# EAGLE board InkTime_Schematic (EAGLE 9.7.0)
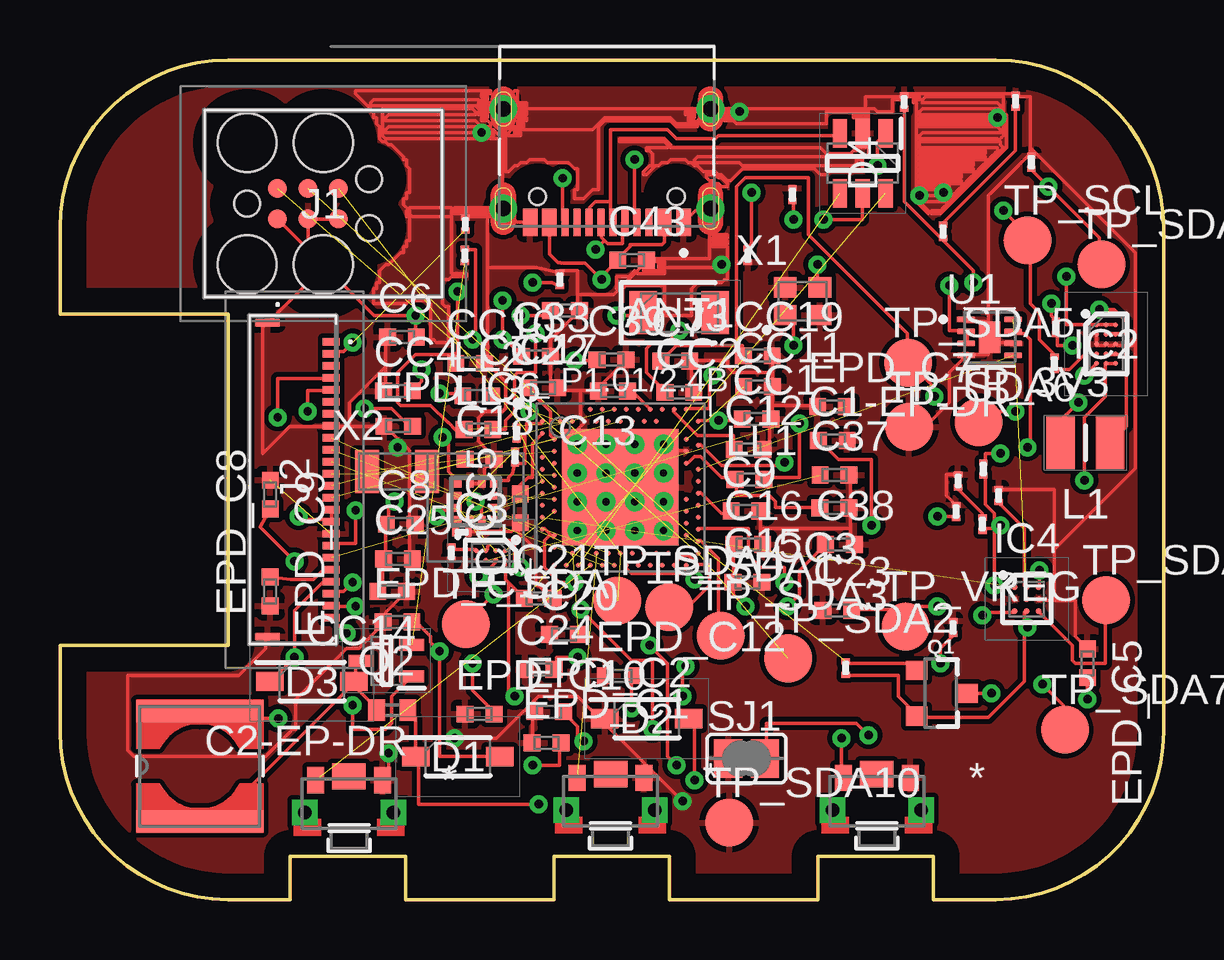
[diagram p2: board, top side]
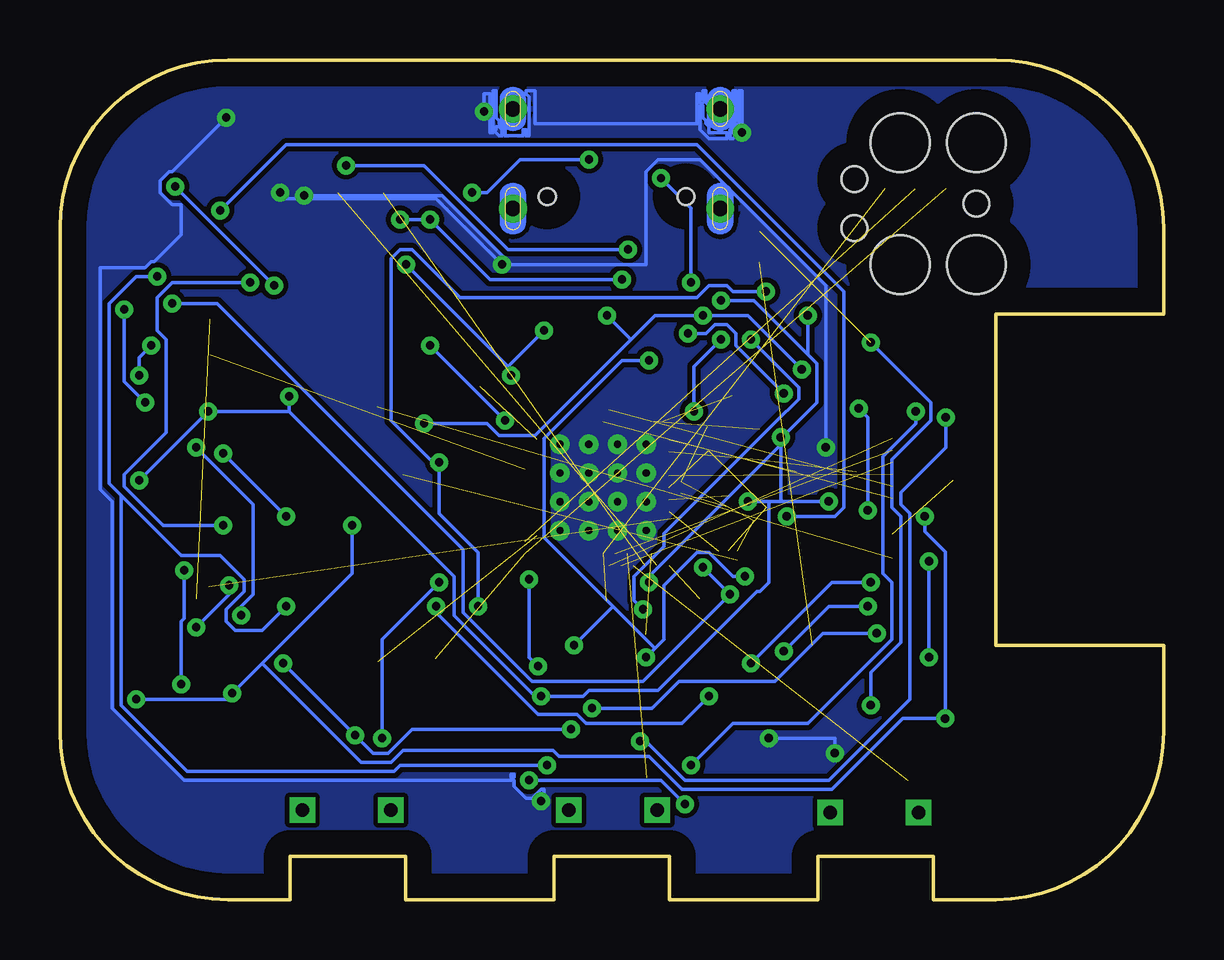
[diagram p3: board, bottom side, seen from below]

Size 46 x 35 mm. Coordinates in mm from the lower left corner, seen from the top.
Outline: 39,0 36.4,0 36.4,1.8 31.6,1.8 31.6,0 25.4,0 25.4,1.8 20.6,1.8 20.6,0 14.4,0 14.4,1.8 9.6,1.8 9.6,0 7,0 arc-90 0,7 0,10.6 7,10.6 7,24.4 0,24.4 0,28 arc-90 7,35 39,35 arc-90 46,28 46,7 arc-90 39,0
Copper layers (1*16): Top 0.035mm / dielectric 1.5mm / Bottom 0.035mm
Design rules "Fusion Electronics Design Rules": minimum track width 6mil, minimum drill 0.35mm, track to track 6mil, track to pad 6mil, pad to pad 6mil, via to via 6mil, smd to smd 6mil, copper to edge 40mil, drill to drill 6mil, minimum pad ring 10mil, minimum via ring 8mil, stop-mask expansion 4mil, vias tented up to drill 9999mil, thermal gap 10mil

## Footprints (pad centres in the part's own frame; a part is rotated, then mirrored left to right if it is on the bottom)
2450AT18B100E_ANTC3216X140N = smd 1.15 x 1.8: 1 -1.5,0; 2 1.5,0
NORDIC_NRF_3_RESC0402_M = smd 0.7 x 0.7: 1 -0.6,0; 2 0.6,0
GRM011R60J152KE01L_1_0201 = smd 0.35 x 0.25: 1 0,0.275; 2 0,-0.275
ESP32_C6_LIBRARY_1_ESP32_WROVER_EAGLE-LTSPICE_C0402 = smd 0.7 x 0.9: 1 -0.65,0; 2 0.65,0
ESP32_C6_LIBRARY_5_SOD3716X135N = smd 1.15 x 0.8: 1 -1.75,0; 2 1.75,0
ESP32_C6_LIBRARY_3_SOT95P280X145-6N = smd 1.2 x 0.6: 1 -1.25,0.95; 2 -1.25,0; 3 -1.25,-0.95; 4 1.25,-0.95; 5 1.25,0; 6 1.25,0.95
BQ25180YBGR_BGA8C40P2X4_100X155X50 = smd 0.2 x 0.2: A1 -0.2,0.6; A2 0.2,0.6; B1 -0.2,0.2; B2 0.2,0.2; C1 -0.2,-0.2; C2 0.2,-0.2; D1 -0.2,-0.6; D2 0.2,-0.6
RT6160AWSC_BGA15C40P3X5_140X230X60 = smd 0.216 x 0.216: A1 -0.4,0.8; A2 0,0.8; A3 0.4,0.8; B1 -0.4,0.4; B2 0,0.4; B3 0.4,0.4; C1 -0.4,0; C2 0,0; C3 0.4,0; D1 -0.4,-0.4; D2 0,-0.4; D3 0.4,-0.4; E1 -0.4,-0.8; E2 0,-0.8; E3 0.4,-0.8
BMA423_BMA423 = smd 0.3 x 0.35: 1 -0.75,-0.775; 2 -0.25,-0.775; 3 0.25,-0.775; 4 0.75,-0.775; 7 0.75,0.775; 8 0.25,0.775; 9 -0.25,0.775; 10 -0.75,0.775 | smd 0.35 x 0.3: 5 0.775,-0.25; 6 0.775,0.25; 11 -0.775,0.25; 12 -0.775,-0.25
DRV2605YZFR_BGA9C50P3X3_144X144X62 = smd 0.25 x 0.25: A1 -0.5,0.5; A2 0,0.5; A3 0.5,0.5; B1 -0.5,0; B2 0,0; B3 0.5,0; C1 -0.5,-0.5; C2 0,-0.5; C3 0.5,-0.5
TC2030-IDC_TC2030IDC = smd 0.783 x 0.783: 1 -0.953,-0.635; 2 -0.953,0.635; 3 0.317,-0.635; 4 0.317,0.635; 5 1.588,-0.635; 6 1.588,0.635 | hole 2.451: -2.223,-2.54; -2.223,2.54; 0.952,-2.54; 0.952,2.54 | hole 1.067: -2.223,0; 2.857,-1.016; 2.857,1.016
503480-2400_5034802400 = smd 0.3 x 0.7: 1 -5.75,1.525; 2 -5.25,1.525; 3 -4.75,1.525; 4 -4.25,1.525; 5 -3.75,1.525; 6 -3.25,1.525; 7 -2.75,1.525; 8 -2.25,1.525; 9 -1.75,1.525; 10 -1.25,1.525; 11 -0.75,1.525; 12 -0.25,1.525; 13 0.25,1.525; 14 0.75,1.525; 15 1.25,1.525; 16 1.75,1.525; 17 2.25,1.525; 18 2.75,1.525; 19 3.25,1.525; 20 3.75,1.525; 21 4.25,1.525; 22 4.75,1.525; 23 5.25,1.525; 24 5.75,1.525 | smd 0.3 x 1: MP1 -6.54,-1.125; MP2 6.54,-1.125
KH-TYPE-C-16P_KINGHELM_KH-TYPE-C-16P = smd 0.6 x 1.15: A1_B12 -3.2,4.725; A4_B9 -2.4,4.725; A9_B4 2.4,4.725; A12_B1 3.2,4.725 | smd 0.3 x 1.15: A5 -1.25,4.725; A6 -0.25,4.725; A7 0.25,4.725; A8 1.25,4.725; B5 1.75,4.725; B6 0.75,4.725; B7 -0.75,4.725; B8 -1.75,4.725 | drill 0.65 pad 1.05: SH1 -4.32,0; SH2 4.32,0; SH3 -4.32,4.15; SH4 4.32,4.15 | hole 0.7: -2.89,3.65; 2.89,3.65
MLP2016SR47MT0S1_INDC2016X100N = smd 1.2 x 2.2: 1 -1.028,0; 2 1.028,0
ESP32_C6_LIBRARY_2_IND_4828-WE-TPC_WRE = smd 0.9 x 5.3: 1 -2.286,0; 2 2.286,0
NORDIC_NRF_2_RESC0402_M = smd 0.7 x 0.7: 1 -0.6,0; 2 0.6,0
NORDIC_NRF_4_AQFN50P700X700X85_HS-74N = smd 4.85 x 4.85: P$74 0,0 | drill 0.3 pad 0.6: P$75 -1.8,1.8; P$76 -0.6,1.8; P$77 0.6,1.8; P$78 1.8,1.8; P$79 -1.8,0.6; P$80 -0.6,0.6; P$81 0.6,0.6; P$82 1.8,0.6; P$83 -1.8,-0.6; P$84 -0.6,-0.6; P$85 0.6,-0.6; P$86 1.8,-0.6; P$87 -1.8,-1.8; P$88 -0.6,-1.8; P$89 0.6,-1.8; P$90 1.8,-1.8 | smd 0.2 x 0.2: P$A8 -1.25,3.25; P$A10 -0.75,3.25; P$A12 -0.25,3.25; P$A14 0.25,3.25; P$A16 0.75,3.25; P$A18 1.25,3.25; P$A20 1.75,3.25; P$A22 2.25,3.25; P$A23 2.75,3.25; P$AA24 3.25,-2.25; P$AB2 -2.75,-2.5; P$AC5 -2,-2.75; P$AC9 -1,-2.75; P$AC11 -0.5,-2.75; P$AC13 0,-2.75; P$AC15 0.5,-2.75; P$AC17 1,-2.75; P$AC19 1.5,-2.75; P$AC21 2,-2.75; P$AC24 3.25,-2.75; P$AD2 -2.75,-3.25; P$AD4 -2.25,-3.25; P$AD6 -1.75,-3.25; P$AD8 -1.25,-3.25; P$AD10 -0.75,-3.25; P$AD12 -0.25,-3.25; P$AD14 0.25,-3.25; P$AD16 0.75,-3.25; P$AD18 1.25,-3.25; P$AD20 1.75,-3.25; P$AD22 2.25,-3.25; P$AD23 2.75,-3.25; P$B1 -3.25,2.75; P$B3 -2.5,2.75; P$B5 -2,2.75; P$B7 -1.5,2.75; P$B9 -1,2.75; P$B11 -0.5,2.75; P$B13 0,2.75; P$B15 0.5,2.75; P$B17 1,2.75; P$B19 1.5,2.75; P$B24 3.25,2.75; P$C1 -3.25,2.25; P$D2 -2.75,2; P$D23 2.75,2; P$E24 3.25,1.75; P$F2 -2.75,1.5; P$F23 2.75,1.5; P$G1 -3.25,1.25; P$H2 -2.75,1; P$H23 2.75,1; P$J1 -3.25,0.75; P$J24 3.25,0.75; P$K2 -2.75,0.5; P$L1 -3.25,0.25; P$L24 3.25,0.25; P$M2 -2.75,0; P$N1 -3.25,-0.25; P$N24 3.25,-0.25; P$P2 -2.75,-0.5; P$P23 2.75,-0.5; P$R1 -3.25,-0.75; P$R24 3.25,-0.75; P$T2 -2.75,-1; P$T23 2.75,-1; P$U1 -3.25,-1.25; P$U24 3.25,-1.25; P$V23 2.75,-1.5; P$W1 -3.25,-1.75; P$W24 3.25,-1.75; P$Y2 -2.75,-2; P$Y23 2.75,-2
ESP32_C6_LIBRARY_4_ESP32_C6_LIBRARY_4_ESP32_C6_LIBRARY_4_ESP32_C6_LIBRARY_4_ESP32_WROVER_SPARKFUN-DISCRETESEMI_SOT23-3 = smd 0.8 x 0.9: 1 -0.95,-1; 2 0.95,-1; 3 0,1.1
ESP32_C6_LIBRARY_6_SOT65P210X110-3N = smd 1.05 x 0.5: 1 -1.05,0.65; 2 -1.05,-0.65; 3 1.05,0
CPF0201D7K68C1_0201 = smd 0.35 x 0.25: 1 0,0.275; 2 0,-0.275
ESP32_C6_LIBRARY_7_JUMPER_SJ = smd 1.168 x 1.6: 1 -0.762,0; 2 0.762,0
2025-10-22_07-23-44_LIBRARY_SW_EVP-AKE31A_PAN = smd 0.711 x 1.092: 1 -1.4,-0.972; 2 1.4,-0.972 | drill 0.559 pad 0.914 square: 3 -1.848,0.381; 4 1.848,0.381 | smd 1.397 x 1.092: 5 0,-1.124
HECTOR_WATCH_1_TP20R = smd 2 x 2: TP 0,0
ESP32_C6_LIBRARY_SON50P200X200X80-9N = smd 0.76 x 0.27: 1 -0.985,0.75; 2 -0.985,0.25; 3 -0.985,-0.25; 4 -0.985,-0.75; 5 0.985,-0.75; 6 0.985,-0.25; 7 0.985,0.25; 8 0.985,0.75 | smd 0.9 x 1.3: 9 0,0
NORDIC_NRF_BT-XTAL_2016_N = smd 0.95 x 0.85: 1 -0.725,-0.575; 2 0.725,-0.575; 3 0.725,0.575; 4 -0.725,0.575
NORDIC_NRF_1_XTAL_3215_N = smd 1 x 1.8: 1 -1.25,0; 2 1.25,0

## Placement (x,y rotation side)
ANT1  2450AT18B100E_2450AT18B100E  [2450AT18B100E_ANTC3216X140N]  25.82,24.46 0 top
C1-EP-DR  10uF  [NORDIC_NRF_3_RESC0402_M]  32.21,19.13 0 top
C2  GRM011R60J152KE01L_1_GRM011R60J152KE01L  [GRM011R60J152KE01L_1_0201]  40.49,30.74 0 top
C2-EP-DR  4.7uF/25V  [ESP32_C6_LIBRARY_1_ESP32_WROVER_EAGLE-LTSPICE_C0402]  13.85,7.9 180 top
C3  1uF  [GRM011R60J152KE01L_1_0201]  39.13,16.85 0 top
C4  0.1uF  [GRM011R60J152KE01L_1_0201]  35.19,33.25 0 top
C5  GRM011R60J152KE01L_1_GRM011R60J152KE01L  [GRM011R60J152KE01L_1_0201]  37.35,16.18 0 top
C6  4.7uF  [NORDIC_NRF_3_RESC0402_M]  14.25,23.45 0 top
C7  100nF  [NORDIC_NRF_3_RESC0402_M]  25.65,22.45 0 top
C8  100nF  [NORDIC_NRF_3_RESC0402_M]  14.2,15.65 0 top
C9  820pF  [NORDIC_NRF_3_RESC0402_M]  28.58,16.19 0 top
C10  GRM011R60J152KE01L_1_GRM011R60J152KE01L  [GRM011R60J152KE01L_1_0201]  37.44,17.45 0 top
C11  GRM011R60J152KE01L_1_GRM011R60J152KE01L  [GRM011R60J152KE01L_1_0201]  39.84,33.28 0 top
C12  100pF  [NORDIC_NRF_3_RESC0402_M]  28.7,18.76 0 top
C13  N.C  [NORDIC_NRF_3_RESC0402_M]  23.05,21.2 180 top
C15  1uF  [NORDIC_NRF_3_RESC0402_M]  28.66,13.23 0 top
C16  47nF  [NORDIC_NRF_3_RESC0402_M]  28.69,14.8 0 top
C17  12pF  [NORDIC_NRF_3_RESC0402_M]  20.14,21.33 0 top
C18  12pF  [NORDIC_NRF_3_RESC0402_M]  17.49,18.35 0 top
C20  4.7uF  [NORDIC_NRF_3_RESC0402_M]  21,11.05 0 top
C21  4.7uF  [NORDIC_NRF_3_RESC0402_M]  19.95,12.55 0 top
C23  0.1uF  [NORDIC_NRF_3_RESC0402_M]  32.4,12.05 0 top
C24  10uF  [NORDIC_NRF_3_RESC0402_M]  19.99,9.6 0 top
C25  22uF  [NORDIC_NRF_3_RESC0402_M]  14.09,14.2 0 top
C33  22uF  [NORDIC_NRF_3_RESC0402_M]  19.84,22.64 0 top
C37  1uF  [NORDIC_NRF_3_RESC0402_M]  32.29,17.7 0 top
C38  1uF  [NORDIC_NRF_3_RESC0402_M]  32.51,14.8 0 top
C39  10uF  [NORDIC_NRF_3_RESC0402_M]  22.99,22.5 0 top
C42  GRM011R60J152KE01L_1_GRM011R60J152KE01L  [GRM011R60J152KE01L_1_0201]  30.53,29.38 0 top
C43  4.7uF  [NORDIC_NRF_3_RESC0402_M]  23.85,26.65 0 top
CC1  12pF  [NORDIC_NRF_3_RESC0402_M]  29.04,20.03 0 top
CC2  12pF  [NORDIC_NRF_3_RESC0402_M]  25.82,21.14 0 top
CC3  1pF  [NORDIC_NRF_3_RESC0402_M]  32.28,16.32 180 top
CC4  1pF  [NORDIC_NRF_3_RESC0402_M]  14.09,21.2 0 top
CC5  100nF  [NORDIC_NRF_3_RESC0402_M]  19.19,16.31 90 top
CC10  N.C  [NORDIC_NRF_3_RESC0402_M]  17.1,22.35 0 top
CC11  100pF  [NORDIC_NRF_3_RESC0402_M]  29.1,21.38 0 top
CC14  4.7uF  [NORDIC_NRF_3_RESC0402_M]  13.85,12.85 180 top
CC19  100nF  [NORDIC_NRF_3_RESC0402_M]  29.09,22.67 0 top
CC22  N.C  [NORDIC_NRF_3_RESC0402_M]  21.05,24.55 180 top
D1  ESP32_C6_LIBRARY_5_MBR0530  [ESP32_C6_LIBRARY_5_SOD3716X135N]  16.59,5.96 0 top
D2  ESP32_C6_LIBRARY_5_MBR0530  [ESP32_C6_LIBRARY_5_SOD3716X135N]  24.46,7.54 0 top
D3  ESP32_C6_LIBRARY_5_MBR0530  [ESP32_C6_LIBRARY_5_SOD3716X135N]  10.5,9.09 0 top
D4  ESP32_C6_LIBRARY_3_USBLC6-2SC6Y  [ESP32_C6_LIBRARY_3_SOT95P280X145-6N]  33.46,30.69 270 top
EPD_C1  1uF/50V  [NORDIC_NRF_3_RESC0402_M]  20.28,6.53 0 top
EPD_C2  1uF/50V  [NORDIC_NRF_3_RESC0402_M]  20.39,7.83 0 top
EPD_C5  0.1uF/50V  [NORDIC_NRF_3_RESC0402_M]  42.83,9.85 270 top
EPD_C6  1uF/50V  [NORDIC_NRF_3_RESC0402_M]  14.1,19.73 0 top
EPD_C7  1uF/50V  [NORDIC_NRF_3_RESC0402_M]  32.18,20.55 0 top
EPD_C8  1uF/50V  [NORDIC_NRF_3_RESC0402_M]  8.77,12.84 90 top
EPD_C9  1uF/50V  [NORDIC_NRF_3_RESC0402_M]  8.77,16.88 270 top
EPD_C10  1uF/50V  [NORDIC_NRF_3_RESC0402_M]  17.49,7.73 0 top
EPD_C11  1uF/50V  [NORDIC_NRF_3_RESC0402_M]  14.07,11.58 0 top
EPD_C12  1uF/50V  [NORDIC_NRF_3_RESC0402_M]  23.33,9.33 0 top
IC1  BQ25180YBGR_BQ25180YBGR  [BQ25180YBGR_BGA8C40P2X4_100X155X50]  17.96,14.34 270 top
IC2  RT6160AWSC_RT6160AWSC  [RT6160AWSC_BGA15C40P3X5_140X230X60]  43.61,23.16 0 top
IC3  BMA423_BMA423  [BMA423_BMA423]  17.33,16.59 0 top
IC4  DRV2605YZFR_DRV2605YZFR  [DRV2605YZFR_BGA9C50P3X3_144X144X62]  40.3,12.53 0 top
J1  TC2030-IDC_TC2030-IDC  [TC2030-IDC_TC2030IDC]  10.02,29.01 0 top
J2  503480-2400_503480-2400  [503480-2400_5034802400]  9.78,17.5 270 top
J3  KH-TYPE-C-16P_KH-TYPE-C-16P  [KH-TYPE-C-16P_KINGHELM_KH-TYPE-C-16P]  22.8,32.96 180 top
L1  MLP2016SR47MT0S1_FTC252012SR47MBCA  [MLP2016SR47MT0S1_INDC2016X100N]  42.74,19.04 0 top
L2  ESP32_C6_LIBRARY_2_744043680IND_4828-WE-TPC_WRE  [ESP32_C6_LIBRARY_2_IND_4828-WE-TPC_WRE]  5.83,5.56 90 top
LL1  3.9nH  [NORDIC_NRF_2_RESC0402_M]  28.74,17.5 0 top
LL2  10uH  [NORDIC_NRF_2_RESC0402_M]  17.39,21 0 top
LL3  15uH  [NORDIC_NRF_2_RESC0402_M]  17.44,19.6 0 top
P1.01/2.4B  NORDIC_NRF_4_NRF52840_QF  [NORDIC_NRF_4_AQFN50P700X700X85_HS-74N]  23.36,17.18 0 top
Q1  20V/4.2A/52mΩ/1.4W  [ESP32_C6_LIBRARY_4_ESP32_C6_LIBRARY_4_ESP32_C6_LIBRARY_4_ESP32_C6_LIBRARY_4_ESP32_WROVER_SPARKFUN-DISCRETESEMI_SOT23-3]  36.71,8.6 270 top
Q2  ESP32_C6_LIBRARY_6_SI1308EDL-T1-GE3  [ESP32_C6_LIBRARY_6_SOT65P210X110-3N]  13.61,9.96 180 top
R1  10K  [CPF0201D7K68C1_0201]  16.31,14.45 180 top
R2  CPF0201D7K68C1_CPF0201D7K68C1  [CPF0201D7K68C1_0201]  41.45,22.35 0 top
R3  CPF0201D7K68C1_CPF0201D7K68C1  [CPF0201D7K68C1_0201]  41.51,23.85 0 top
R4  CPF0201D7K68C1_CPF0201D7K68C1  [CPF0201D7K68C1_0201]  18.97,18.45 0 top
R5  CPF0201D7K68C1_CPF0201D7K68C1  [CPF0201D7K68C1_0201]  19.03,19.45 0 top
R6  CPF0201D7K68C1_CPF0201D7K68C1  [CPF0201D7K68C1_0201]  16.89,28.15 0 top
R7  CPF0201D7K68C1_CPF0201D7K68C1  [CPF0201D7K68C1_0201]  32.75,9.65 0 top
R8  CPF0201D7K68C1_CPF0201D7K68C1  [CPF0201D7K68C1_0201]  16.75,15.31 90 top
R9  CPF0201D7K68C1_CPF0201D7K68C1  [CPF0201D7K68C1_0201]  16.87,26.85 0 top
R10  CPF0201D7K68C1_CPF0201D7K68C1  [CPF0201D7K68C1_0201]  37.23,11.35 0 top
R11  CPF0201D7K68C1_CPF0201D7K68C1  [CPF0201D7K68C1_0201]  38.49,17.95 0 top
R12  CPF0201D7K68C1_CPF0201D7K68C1  [CPF0201D7K68C1_0201]  38.45,15.65 0 top
R13  CPF0201D7K68C1_CPF0201D7K68C1  [CPF0201D7K68C1_0201]  36.81,27.85 0 top
R14  CPF0201D7K68C1_CPF0201D7K68C1  [CPF0201D7K68C1_0201]  28.67,26.85 0 top
R15  CPF0201D7K68C1_CPF0201D7K68C1  [CPF0201D7K68C1_0201]  20.83,25.85 0 top
SJ1  0  [ESP32_C6_LIBRARY_7_JUMPER_SJ]  28.62,5.88 0 top
SW1  2025-10-22_07-23-44_LIBRARY_EVP-AKE31ASW_EVP-AKE31A_PAN  [2025-10-22_07-23-44_LIBRARY_SW_EVP-AKE31A_PAN]  12.05,4.01 180 top
SW2  2025-10-22_07-23-44_LIBRARY_EVP-AKE31ASW_EVP-AKE31A_PAN  [2025-10-22_07-23-44_LIBRARY_SW_EVP-AKE31A_PAN]  22.95,4.11 180 top
SW3  2025-10-22_07-23-44_LIBRARY_EVP-AKE31ASW_EVP-AKE31A_PAN  [2025-10-22_07-23-44_LIBRARY_SW_EVP-AKE31A_PAN]  34.05,4.11 180 top
TP_3V3  HECTOR_WATCH_1_TPTP20R  [HECTOR_WATCH_1_TP20R]  38.3,19.9 0 top
TP_SCL  HECTOR_WATCH_1_TPTP20R  [HECTOR_WATCH_1_TP20R]  40.33,27.48 0 top
TP_SDA  HECTOR_WATCH_1_TPTP20R  [HECTOR_WATCH_1_TP20R]  16.92,11.48 0 top
TP_SDA1  HECTOR_WATCH_1_TPTP20R  [HECTOR_WATCH_1_TP20R]  25.39,12.19 0 top
TP_SDA2  HECTOR_WATCH_1_TPTP20R  [HECTOR_WATCH_1_TP20R]  30.35,10.05 0 top
TP_SDA3  HECTOR_WATCH_1_TPTP20R  [HECTOR_WATCH_1_TP20R]  27.55,11 0 top
TP_SDA4  HECTOR_WATCH_1_TPTP20R  [HECTOR_WATCH_1_TP20R]  23.23,12.46 0 top
TP_SDA5  HECTOR_WATCH_1_TPTP20R  [HECTOR_WATCH_1_TP20R]  35.35,22.38 0 top
TP_SDA6  HECTOR_WATCH_1_TPTP20R  [HECTOR_WATCH_1_TP20R]  35.39,19.7 0 top
TP_SDA7  HECTOR_WATCH_1_TPTP20R  [HECTOR_WATCH_1_TP20R]  41.89,7.08 0 top
TP_SDA8  HECTOR_WATCH_1_TPTP20R  [HECTOR_WATCH_1_TP20R]  43.61,12.48 0 top
TP_SDA9  HECTOR_WATCH_1_TPTP20R  [HECTOR_WATCH_1_TP20R]  43.41,26.48 0 top
TP_SDA10  HECTOR_WATCH_1_TPTP20R  [HECTOR_WATCH_1_TP20R]  27.9,3.2 0 top
TP_VREG  HECTOR_WATCH_1_TPTP20R  [HECTOR_WATCH_1_TP20R]  35.25,11.38 0 top
U1  ESP32_C6_LIBRARY_MAX17048G+T10  [ESP32_C6_LIBRARY_SON50P200X200X80-9N]  38.75,23.44 0 top
X1  32MHz  [NORDIC_NRF_BT-XTAL_2016_N]  30.96,24.94 0 top
X2  32.768KHz  [NORDIC_NRF_1_XTAL_3215_N]  14.06,17.84 0 top

## Tracks (layer width: path | path; a pad name or v marks a point on that pad's centre or on a via)
3V3/1.7D  (via drill 0.35)
  Top 0.152: C4.2 35.2,29.1 36.7,27.6 R13.2 36.83,27.48 38.08,26.23 v38.08,25.73 | 38.95,15.48 38.45,15.48 R12.2 | 38.95,15.6 38.95,16.1 38.58,16.48 38.58,17.6 R11.2 | 38.95,15.6 38.95,15.48 | 40.2,11.35 40.2,9.1 38.7,7.6 35.83,7.6 Q1.2 35.7,7.73 34.95,8.48 34.95,9.35 32.83,9.35 R7.2 | 40.2,11.35 40.2,11.98 IC4.C2 | v38.95,13.1 38.95,15.48 | 40.2,11.35 v40.33,11.35 | 38.95,15.6 v39.2,15.6
  Bottom 0.152: v38.95,13.1 38.95,12.73 v40.33,11.35 | v38.08,25.73 41.33,25.73 41.95,25.1 41.95,23.73 41.58,23.35 41.58,19.48 43.33,17.73 43.33,17.23 41.7,15.6 v39.2,15.6
3V3/2.4A  (via drill 0.35)
  Top 0.152: C7.1 25.7,23.1 28.2,23.1 | 28.2,23.1 28.45,23.1 28.45,22.73 CC19.1 | 28.2,23.1 28.2,29.73 28.57,30.1 31.2,30.1 31.2,27.73 35.33,23.6 35.33,22.48 TP_SDA5.TP 35.45,22.35 36.45,21.35 v36.45,20.98 | IC2.E3 43.95,22.35 43.7,22.35 IC2.E2 43.58,22.35 43.58,20.98 42.7,20.1 v42.7,17.48 | v39.83,20.35 38.33,20.35 38.33,19.98 TP_3V3.TP | IC3.7 18.2,17.48 18.7,17.48 18.7,17.6 18.86,17.76 18.94,18.15 R4.2 19.38,18.18 19.38,19.33 19.34,19.36 | 19.57,19.85 19.45,19.85 19.45,19.48 19.34,19.36 | 19.57,19.85 20.07,19.85 P1.01/2.4B.P$B1 | 19.34,19.36 19.07,19.1 R5.2 | CC14.2 13.32,12.85 13.45,12.98 13.45,14.1 C25.1 13.57,14.23 13.57,15.6 C8.1 13.7,15.73 13.7,16.35 v13.95,16.6 | 26.07,13.6 23.82,13.6 23.57,13.85 P1.01/2.4B.P$AD14 | 26.07,13.6 26.07,13.85 P1.01/2.4B.P$AD23 | 20.45,15.23 20.57,15.1 P1.01/2.4B.P$Y2 | 20.45,15.23 20.2,15.48 P1.01/2.4B.P$W1 | v17.32,16.6 17.57,16.35 17.57,15.85 IC3.3 | IC3.10 16.57,17.48 16.2,17.85 16.2,18.98 15.95,19.23 v15.95,19.27 | 20.45,15.23 20.2,14.98 20.2,13.85 20.82,13.23 v21.45,13.23 | C6.2 14.82,23.48 v14.82,24.35 13.09,24.35 J1.1 | 18.45,23.48 19.2,22.73 C33.1 | 18.45,23.48 v18.45,24.98 | 26.07,13.6 26.45,13.6 v26.45,13.35 | v26.07,9.73 25.95,9.6 v25.95,8.48 | 19.57,19.85 v19.57,20.35 | 18.45,23.48 v18.45,23.35
  Bottom 0.152: v42.7,17.48 v39.83,20.35 36.45,20.35 | v13.95,16.6 15.95,16.6 | 15.95,16.6 16.45,16.6 | 16.45,16.6 v17.32,16.6 | 15.95,16.6 15.95,18.98 | v21.45,13.23 21.45,13.48 15.95,18.98 | 15.95,18.98 15.95,19.23 | 14.82,22.73 v14.82,24.35 | 14.82,22.73 14.45,22.35 14.45,20.73 15.95,19.23 | v18.45,24.98 17.07,24.98 14.82,22.73 | v26.45,13.35 26.45,10.1 v26.07,9.73 | 16.45,16.6 16.45,13.23 16.82,12.85 16.95,12.85 21.07,8.73 23.95,8.73 24.2,8.48 v25.95,8.48 26.2,8.48 29.57,11.85 29.57,13.48 36.45,20.35 | v19.57,20.35 19.57,22.23 v18.45,23.35 | 36.45,20.35 v36.45,20.98 | v15.95,19.27 15.95,19.23
ALERT  (1 unrouted)
D+  (1 unrouted)
D-  (1 unrouted)
DN  (via drill 0.35)
  Top 0.152: 22.7,27.48 22.82,27.35 23.45,27.35 23.45,28.23 J3.B7 | 22.7,27.48 22.57,27.6 22.57,28.23 J3.A7 | v34.08,30.6 34.08,31.6 34.33,31.85 D4.1 | 22.7,27.48 v22.32,27.1
  Bottom 0.152: v34.08,30.6 30.82,30.6 27.32,27.1 v22.32,27.1
DP
  Top 0.152: 22.95,29.1 22.32,29.1 22.07,28.85 22.07,28.35 J3.B6 | 22.95,29.1 22.95,28.35 J3.A6 | 22.95,29.1 22.95,32.1 25.32,32.1 25.7,31.73 27.32,31.73 27.45,31.85 32.45,31.85 D4.3
EPD_3V3  (via drill 0.35)
  Top 0.152: J2.15 11.32,16.23 11.32,15.85 J2.16 11.2,15.85 9.95,15.85 v9.95,15.98 | v9.1,7.55 5.95,7.55 5.95,7.73 L2.2 | v42.83,8.35 42.83,9.23 EPD_C5.2 | Q1.3 v38.83,8.6 | v33.83,15.6 33.83,18.35 32.45,18.35 31.7,19.1 C1-EP-DR.1
  Bottom 0.152: v9.95,15.98 9.95,15.35 9.1,14.5 v9.1,7.55 10.88,7.55 13.82,4.6 20.07,4.6 21.45,5.98 25.2,5.98 25.45,6.23 31.7,6.23 32.2,5.73 33.45,5.73 37.58,9.85 | v42.83,8.35 39.08,8.35 v38.83,8.6 37.58,9.85 | v33.83,15.6 33.83,13.6 37.58,9.85
EPD_BUSY  (1 unrouted)
EPD_CS  (1 unrouted)
EPD_DC  (1 unrouted)
EPD_RST  (1 unrouted)
GDR  (via drill 0.35)  (1 unrouted)
  Top 0.152: v12.2,23.23 11.82,22.85 11.32,22.85 J2.2 | 16.82,27.85 R6.2 | v12.2,8.1 12.2,7.1 13.57,7.1 13.82,7.35 13.82,8.48 14.57,9.23 Q2.1
  Bottom 0.152: v12.2,8.1 12.2,9.48 10.95,10.73 10.95,15.98 11.32,16.35 11.32,18.35 9.7,19.98 9.7,20.73 v12.2,23.23
GND  (via drill 0.35)  (1 unrouted)
  Top 0.152: 29.2,15.48 29.2,16.1 C9.2 | 29.2,15.48 29.2,14.85 C16.2 | 32.95,15.48 32.95,16.23 CC3.1 32.95,16.35 32.95,17.6 C37.2 | 32.95,15.48 32.95,14.98 33.08,14.85 C38.2 | 32.95,15.48 29.2,15.48 | CC2.2 26.32,21.23 26.32,22.35 C7.2 26.32,22.48 27.82,22.48 27.82,22.23 28.07,21.98 29.7,21.98 | 29.7,21.98 29.7,22.6 CC19.2 | 29.7,21.98 CC11.2 29.7,20.6 | C12.2 29.32,18.85 29.57,19.1 29.57,19.98 CC1.2 29.7,20.1 29.7,20.6 | 29.7,20.6 31.57,20.6 EPD_C7.1 | 38.7,23.23 38.7,23.35 U1.9 | 38.7,23.23 38.7,22.73 37.83,22.73 U1.4 37.7,22.6 37.08,21.98 37.08,20.73 35.7,19.35 | 38.7,24.1 37.83,24.1 U1.1 | 38.7,24.1 38.7,23.48 U1.9 | 38.7,23.23 39.7,23.23 U1.6 | 38.7,23.23 U1.9 | 35.7,19.35 35.45,19.6 TP_SDA6.TP 35.7,19.35 | 12.07,19.73 11.32,19.73 J2.8 11.2,19.73 9.57,19.73 8.45,18.6 8.45,23.85 8.57,23.98 J2.MP1 10.34,25.73 J1.3 J1.5 | 12.07,19.73 13.45,19.73 EPD_C6.1 13.57,19.73 14.32,18.98 | 13.57,22.23 13.57,23.35 C6.1 | 13.57,22.23 13.57,21.23 CC4.1 | 12.07,19.73 12.07,20.73 13.57,22.23 | 14.32,18.98 14.57,18.73 14.57,14.23 C25.2 | 25.2,18.98 25.2,18.73 26.07,18.73 P1.01/2.4B.P$F23 | 21.57,19.1 21.57,19.6 21.82,19.85 P1.01/2.4B.P$B7 21.82,19.98 21.7,20.1 21.7,21.23 | 21.57,16.48 21.57,15.48 P1.01/2.4B.P$87 | 21.57,16.48 P1.01/2.4B.P$83 | 21.57,16.48 P1.01/2.4B.P$74 | P1.01/2.4B.P$88 22.82,15.48 22.82,16.48 P1.01/2.4B.P$74 | P1.01/2.4B.P$84 22.82,16.6 P1.01/2.4B.P$74 | P1.01/2.4B.P$79 21.57,17.85 22.07,18.35 22.07,18.48 P1.01/2.4B.P$74 | P1.01/2.4B.P$80 22.82,17.73 P1.01/2.4B.P$74 | 25.07,15.35 24.07,15.35 P1.01/2.4B.P$89 | P1.01/2.4B.P$85 23.95,16.6 P1.01/2.4B.P$74 | P1.01/2.4B.P$81 23.95,17.73 P1.01/2.4B.P$74
  Top 0.152: 25.07,15.35 P1.01/2.4B.P$90 | 25.07,15.35 P1.01/2.4B.P$74 | P1.01/2.4B.P$86 25.07,16.48 24.57,15.98 P1.01/2.4B.P$74 | 24.57,18.35 25.07,17.85 P1.01/2.4B.P$82 | 21.57,19.1 P1.01/2.4B.P$75 | 21.57,19.1 P1.01/2.4B.P$74 | P1.01/2.4B.P$76 22.7,18.98 22.2,18.48 P1.01/2.4B.P$74 | 24.57,18.35 24.57,18.48 24.07,18.98 P1.01/2.4B.P$77 | 24.57,18.35 P1.01/2.4B.P$74 | 25.2,18.98 P1.01/2.4B.P$78 | 25.2,18.98 P1.01/2.4B.P$74 | 27.07,28.73 27.07,26.73 24.45,26.73 C43.2 24.45,26.6 23.07,25.23 21.57,25.23 | 27.07,28.73 J3.SH3 27.2,28.85 27.2,29.98 27.07,29.98 26.95,30.1 26.95,30.23 27.32,30.23 27.45,30.1 27.57,30.1 27.82,29.85 27.82,29.73 27.57,29.73 27.45,29.85 27.32,29.85 27.32,28.73 27.2,28.6 27.2,27.73 27.82,27.73 27.82,27.6 27.2,27.6 27.2,27.48 27.82,27.48 27.82,27.35 27.2,27.35 27.2,27.23 27.82,27.23 27.82,25.85 27.7,25.85 27.57,25.73 26.57,25.73 26.32,25.48 26.32,24.35 25.2,24.35 25.2,25.6 23.57,25.6 23.32,25.35 23.2,25.48 23.2,25.98 23.7,25.98 23.95,26.23 24.07,26.1 25.2,26.1 25.2,26.23 24.32,26.23 24.32,26.35 24.7,26.35 24.7,26.6 25.2,26.6 25.2,26.48 24.95,26.48 24.95,26.35 27.45,26.35 v27.57,26.48 | 21.57,25.23 21.57,24.6 CC22.1 21.57,24.48 20.45,23.35 20.45,22.73 C33.2 20.45,22.6 20.45,21.6 20.7,21.35 C17.2 20.82,21.23 21.7,21.23 | 21.57,25.23 21.57,26.23 20.85,26.23 R15.1 19.88,26.35 17.82,26.35 | 21.7,21.23 22.45,21.23 | 22.45,21.23 22.45,21.35 23.57,22.48 C39.2 | 22.45,21.23 C13.2 | IC2.B1 43.2,23.48 43.2,23.23 IC2.C1 43.2,23.1 43.58,23.1 IC2.C2 43.7,23.1 43.95,23.1 IC2.C3 44.08,23.1 44.83,23.1 | 41.45,12.48 42.33,12.48 42.33,10.98 42.83,10.48 EPD_C5.1
  Top 0.152: 41.45,12.48 40.83,12.48 IC4.B3 | 41.45,12.48 41.45,14.6 | 41.45,14.6 41.45,17.1 39.2,17.1 C3.1 | 44.83,23.1 44.83,17.98 41.45,14.6 | 40.45,31.1 40.45,31.35 | 40.45,31.35 40.45,33.48 39.95,33.48 C11.1 39.83,33.6 35.2,33.6 C4.1 35.08,33.48 33.58,33.48 33.58,32.98 | 33.58,32.98 33.58,31.98 D4.2 | 33.58,32.98 27.2,32.98 J3.SH1 27.07,32.98 18.57,32.98 J3.SH2 18.45,32.85 18.45,28.85 | IC3.9 17.2,17.35 IC3.8 17.7,17.48 17.7,17.98 18.07,18.35 C18.2 18.07,18.48 17.45,19.1 17.45,20.1 17.7,20.35 18.45,20.35 18.57,20.48 18.57,21.6 17.82,22.35 | 17.82,28.48 18.45,28.48 18.45,28.73 J3.SH4 | 17.82,28.48 16.95,28.48 R6.1 | 17.82,28.48 17.82,26.35 | 17.82,26.35 17.82,22.35 | 17.82,22.35 CC10.2 | 44.83,23.1 44.83,26.98 40.45,31.35 | 38.7,24.1 38.7,29.35 40.45,31.1 | 40.45,31.1 C2.1 | J3.A12_B1 19.05,28.23 J3.SH4 | J3.A1_B12 26.49,28.73 27.07,28.73 | 18.95,15.48 18.82,15.35 17.07,15.35 R8.2 | 18.95,15.48 19.07,15.6 CC5.1 18.95,15.48 | C10.1 36.95,17.73 36.95,16.85 37.33,16.48 C5.1 | EPD_C1.1 19.7,6.6 19.7,7.73 EPD_C2.1 | 18.95,15.48 19.82,14.6 19.82,13.1 19.95,13.1 20.45,12.6 C21.2 | 18.45,28.85 16.45,28.85 16.32,28.73 16.32,28.6 17.82,28.6 17.95,28.73 18.32,28.73 18.32,28.6 17.95,28.6 17.82,28.73 16.45,28.73 16.32,28.85 14.57,28.85 14.45,28.73 14.45,28.48 14.57,28.48 14.57,27.48 14.45,27.48 14.45,27.23 14.32,27.23 14.32,26.98 14.2,26.98 13.7,26.48 13.57,26.48 13.32,26.23 13.32,25.73 13.2,25.73 13.2,25.48 13.07,25.48 13.07,24.85 14.45,24.85 14.57,24.98 15.32,24.98 15.45,24.85 15.45,23.35 15.57,23.35 15.7,23.23 16.2,23.23 16.2,24.73 16.07,24.73 15.95,24.85 15.95,25.85 16.2,25.85 16.32,25.98 16.95,25.98 16.95,26.1 16.32,26.1 16.32,28.48 14.7,28.48 14.57,28.6 14.57,28.73 14.32,28.98 14.32,29.23 14.45,29.23 14.45,29.48 14.57,29.48 14.57,30.48 14.45,30.6 14.45,30.85 14.32,30.85 14.32,30.98 13.82,31.48 13.7,31.48 13.57,31.6 13.45,31.6 13.32,31.73 13.32,32.23 13.2,32.35 13.2,32.6 13.07,32.6 13.07,32.85 12.95,32.85 12.95,32.98 12.32,33.6 12.32,33.73 17.95,33.73 17.95,33.6 17.57,33.6 17.57,33.48 17.82,33.48 17.82,33.35 17.57,33.35 17.45,33.23 17.45,33.1 19.45,33.1 19.45,33.23 19.07,33.23 19.07,33.73 18.95,33.73 18.45,33.23 17.57,33.23 17.45,33.35 13.07,33.35 12.95,33.23 12.95,33.1 17.32,33.1 17.45,32.98 18.32,32.98 18.32,32.85 17.45,32.85 17.45,32.73 17.82,32.73 17.82,32.6 17.57,32.6 17.57,32.48 17.82,32.48 17.95,32.35 17.95,32.23 17.57,32.23 17.57,32.1 18.07,32.1 18.32,31.85 18.32,31.73 17.95,31.73 17.82,31.85 17.82,31.98 18.07,31.98 18.07,31.85 17.95,31.85 17.82,31.73 13.57,31.73 13.45,31.85 13.45,32.98 17.2,32.98 17.32,32.85 17.32,32.73 13.7,32.73 13.57,32.6 13.57,32.48 17.32,32.48 17.45,32.35 17.45,32.23 13.7,32.23 13.57,32.1 13.57,31.98 v17.57,31.98
  Top 0.152: v28.32,32.85 27.32,32.85 27.2,32.73 27.07,32.73 26.95,32.85 26.07,32.85 26.07,32.73 26.45,32.73 26.45,32.6 26.2,32.6 26.2,32.48 26.45,32.48 26.57,32.35 26.57,32.23 25.7,32.23 25.45,32.48 22.7,32.48 22.45,32.23 22.45,29.6 22.2,29.6 21.82,29.23 21.45,29.23 21.45,29.6 21.57,29.6 21.57,30.48 21.45,30.48 21.2,30.73 20.32,30.73 20.2,30.85 19.57,30.85 19.45,30.73 19.2,30.73 19.07,30.6 18.95,30.6 18.7,30.35 18.57,30.35 18.57,32.73 18.7,32.73 18.82,32.85 19.45,32.85 19.45,32.73 19.07,32.73 19.07,32.6 19.45,32.6 19.45,32.48 19.07,32.48 19.07,32.35 19.32,32.35 19.32,32.23 18.95,32.23 18.7,31.98 18.7,31.85 19.2,31.85 19.2,31.98 18.95,31.98 18.95,32.1 22.2,32.1 22.7,32.6 25.45,32.6 25.7,32.35 26.45,32.35 26.82,32.73 26.95,32.73 27.07,32.6 27.2,32.6 27.32,32.73 28.07,32.73 28.07,32.6 27.7,32.6 27.7,32.48 28.07,32.48 28.2,32.35 31.95,32.35 31.95,32.85 33.45,32.85 33.45,32.73 33.08,32.73 33.08,32.6 33.45,32.6 33.45,32.1 33.33,32.1 33.33,31.73 33.58,31.73 33.58,31.6 33.33,31.6 33.33,31.48 33.58,31.48 33.58,31.35 33.33,31.35 33.2,31.23 33.08,31.23 32.95,31.1 31.95,31.1 31.7,31.35 25.45,31.35 25.2,31.6 23.32,31.6 23.32,31.73 25.2,31.73 25.45,31.48 25.32,31.35 24.45,31.35 24.45,31.23 24.57,31.23 24.7,31.1 24.7,30.6 24.57,30.6 24.32,30.35 24.32,30.23 24.45,30.23 24.82,30.6 24.95,30.6 25.07,30.73 25.32,30.73 25.45,30.85 26.07,30.85 26.2,30.73 26.32,30.73 26.45,30.6 26.57,30.6 26.82,30.35 27.32,30.35 27.45,30.23 27.57,30.23 27.82,29.98 27.95,29.98 28.45,30.48 31.45,30.48 31.7,30.23 31.95,30.23 32.08,30.35 33.45,30.35 33.45,30.85 33.33,30.85 33.2,30.98 26.57,30.98 26.45,30.85 26.45,30.73 28.32,30.73 28.45,30.6 33.08,30.6 33.2,30.73 33.2,30.85 33.33,30.98 33.58,30.98 33.7,31.1 33.7,32.98 33.95,32.98 34.08,32.85 34.7,32.85 34.7,33.35 35.2,33.35 35.33,33.48 35.83,33.48 35.83,33.35 35.58,33.35 35.58,33.23 35.7,33.23 35.7,29.1 35.83,29.1 36.33,28.6 36.7,28.6 39.45,31.35 39.45,32.73 39.33,32.73 39.33,33.48 36.08,33.48 35.95,33.35 35.95,33.23 39.08,33.23 39.2,33.1 39.2,32.98 35.95,32.98 35.83,32.85 35.83,32.73 39.08,32.73 39.2,32.6 39.2,32.48 35.95,32.48 35.83,32.35 35.83,32.23 39.08,32.23 39.2,32.1 39.2,31.98 35.95,31.98 35.83,31.85 35.83,31.73 39.08,31.73 39.2,31.6 39.2,31.48 39.33,31.35 36.7,28.73 36.33,28.73 36.2,28.6 35.83,28.98 35.95,29.1 36.95,29.1 39.08,31.23 39.08,31.35 35.95,31.35 35.83,31.23 35.83,31.1 38.45,31.1 38.58,30.98 38.58,30.85 35.95,30.85 35.83,30.73 35.83,30.6 37.95,30.6 38.08,30.48 38.08,30.35 35.95,30.35 35.83,30.23 35.83,30.1 37.45,30.1 37.58,29.98 37.58,29.85 35.95,29.85 35.83,29.73 35.83,29.6 36.95,29.6 37.08,29.48 37.08,29.35 v35.83,29.35
  Top 0.152: v14.07,18.85 14.2,18.98 14.32,18.98 | 18.45,28.85 J3.SH4 | v36.83,29.48 36.95,29.48 37.08,29.6 37.08,29.73 35.95,29.73 35.83,29.85 35.83,29.98 37.45,29.98 37.58,30.1 37.58,30.23 35.95,30.23 35.83,30.35 35.83,30.48 37.95,30.48 38.08,30.6 38.08,30.73 35.95,30.73 35.83,30.85 35.83,30.98 38.45,30.98 38.58,31.1 38.58,31.23 35.95,31.23 35.83,31.35 35.83,31.6 39.08,31.6 39.33,31.85 39.33,32.35 35.95,32.35 35.83,32.48 35.83,32.6 v39.08,32.6 | v25.95,4.1 21.57,8.48 19.95,8.48 18.2,6.73 v16.45,6.73 | v13.7,6.1 13.7,5.1 13.57,5.1 SW1.1 | CC14.1 13.57,11.98 13.57,11.6 EPD_C11.1 13.45,11.48 12.45,10.48 11.95,10.48 9.82,8.35 9.82,7.1 9.7,7.1 8.57,5.98 3.07,5.98 2.82,6.23 2.82,9.35 7.45,9.35 8.57,10.48 8.57,10.85 J2.MP2
  Bottom 0.152: v17.57,31.98 17.7,32.1 17.7,33.73 17.57,33.73 17.57,32.1 17.95,31.73 18.07,31.73 18.07,32.1 17.95,32.23 17.95,32.35 17.82,32.48 17.82,33.73 17.95,33.73 17.95,32.48 17.82,32.35 17.82,31.98 17.95,31.98 17.95,32.1 19.2,33.35 19.2,33.73 19.07,33.73 19.07,33.35 19.32,33.1 19.32,32.1 18.95,31.73 18.2,31.73 18.2,31.98 18.95,31.98 18.95,32.23 19.07,32.35 19.07,32.48 19.2,32.6 19.2,33.1 19.32,33.23 19.32,33.6 19.45,33.6 19.45,32.35 26.2,32.35 26.2,33.73 26.57,33.73 26.57,33.6 26.45,33.48 26.45,31.85 26.57,31.85 26.57,32.1 26.7,32.1 26.7,31.85 27.45,31.85 27.45,32.1 27.7,32.35 27.7,32.48 27.82,32.6 27.82,33.73 27.95,33.73 27.95,32.1 27.7,31.85 27.57,31.85 27.57,32.1 27.7,32.23 27.82,32.23 27.82,32.1 27.95,31.98 28.07,31.98 28.07,33.6 28.32,33.6 v28.32,32.85 | v35.83,29.35 30.07,29.35 27.2,26.48 21.57,26.48 21.57,30.35 21.07,30.85 19.32,30.85 14.07,25.6 v14.07,18.85 | v27.57,26.48 30.32,29.23 36.83,29.23 v36.83,29.48 | v39.08,32.6 41.33,30.35 41.45,30.35 41.83,29.98 41.83,29.48 41.33,28.98 40.95,28.98 40.95,27.73 42.08,26.6 42.2,26.6 42.45,26.35 44.33,26.35 44.33,17.1 43.83,16.6 43.83,7.98 40.83,4.98 27.2,4.98 27.07,5.1 27.07,5.23 27.2,5.23 27.2,5.1 27.07,4.98 27.07,4.73 26.57,4.23 26.32,4.23 25.95,4.6 25.82,4.6 25.82,4.23 v25.95,4.1 | v16.45,6.73 13.7,6.73 v13.7,6.1
  pour Top (isolate 0.2): -6.17,-3.12 48.27,-3.12 49.72,-1.67 49.72,37.87 48.87,38.72 -6.47,38.72 -6.62,38.57 -6.62,-2.67
  pour Bottom (isolate 0.2): -8.22,-4.22 51.32,-4.22 50.74,-3.64 50.72,-3.62 50.72,38.57 50.07,39.22 -8.07,39.22 -8.22,39.07 -8.22,-4.23
HAPTIC_EN  (1 unrouted)
IMU_INT1  (1 unrouted)
IMU_INT2  (1 unrouted)
LX1  (via drill 0.35)
  Top 0.152: IC2.B2 43.7,23.6 43.95,23.6 IC2.B3 44.08,23.6 44.45,23.6 44.45,24.1 43.95,24.6 v43.33,24.6 | v42.45,20.73 41.83,20.1 41.83,19.1 L1.1
  Bottom 0.152: v43.33,24.6 43.33,21.6 v42.45,20.73
LX2
  Top 0.152: IC2.D2 43.7,22.73 43.95,22.73 IC2.D3 44.08,22.73 44.45,22.73 44.45,19.73 43.83,19.1 L1.2
MOSI  (1 unrouted)
N$1
  Top 0.152: IC1.D1 17.32,14.6 16.32,14.6 16.32,14.73 R1.2
N$2
  Top 0.152: P1.01/2.4B.P$N24 26.7,16.98 27.57,16.1 27.95,16.1 C9.1
N$3
  Top 0.152: P1.01/2.4B.P$H23 26.2,18.23 26.45,18.48 26.7,18.48 27.57,17.6 28.07,17.6 LL1.1 28.2,17.48 28.2,16.85 29.57,16.85 29.82,16.6 29.82,16.35 31.57,16.35 CC3.2
N$4
  Top 0.152: IC2.D1 43.2,22.73 42.7,22.73 42.08,22.1 41.45,22.1 R2.2
N$5  (via drill 0.35)
  Top 0.152: v42.7,21.85 IC2.E1 | v42.2,23.1 41.58,23.1 41.58,23.48 R3.2
  Bottom 0.152: v42.7,21.85 42.7,22.6 v42.2,23.1
N$6  (1 unrouted)
N$7  (via drill 0.35)
  Top 0.152: v15.07,22.1 15.07,21.6 14.7,21.23 CC4.2 | v19.2,24.35 20.45,24.35 20.45,24.48 CC22.2 | v30.82,19.85 30.82,17.6 29.45,17.6 LL1.2 | v23.2,24.35 24.2,24.35 ANT1.1
  Bottom 0.152: v15.07,22.1 17.32,24.35 v19.2,24.35 21.2,24.35 22.2,23.35 | v30.82,19.85 28.2,19.85 27.7,19.35 26.2,19.35 22.2,23.35 | 22.2,23.35 v23.2,24.35
N$8  (via drill 0.35)
  Top 0.152: P1.01/2.4B.P$B24 26.7,19.98 v27.45,19.98 28.32,19.98 CC1.1 | v30.57,23.1 30.57,24.1 30.32,24.35 X1.1
  Bottom 0.152: v27.45,19.98 v30.57,23.1
N$9  (via drill 0.35)
  Top 0.152: v27.2,21.85 27.07,21.73 27.07,20.48 26.2,20.48 P1.01/2.4B.P$A23 | v31.57,26.48 31.57,25.6 X1.3 | v25.82,23.73 25.32,23.23 24.7,23.23 24.45,22.98 24.45,21.98 25.2,21.23 CC2.1
  Bottom 0.152: v31.57,26.48 27.32,22.23 | 27.32,22.23 27.2,22.1 v27.2,21.85 27.32,22.23 | 27.32,22.23 v25.82,23.73
N$10  (1 unrouted)
N$11  (2 unrouted)
N$12
  Top 0.152: P1.01/2.4B.P$A22 25.57,20.35 26.57,19.35 28.07,19.35 28.07,18.85 C12.1
N$13
  Top 0.152: P1.01/2.4B.P$A18 24.57,20.48 23.95,21.1 23.7,21.1 C13.1
N$14  (via drill 0.35)
  Top 0.152: LL3.2 18.57,19.6 18.57,19.98 18.95,20.35 18.95,21.85 19.07,21.98 19.82,21.98 v19.82,23.6 | v15.82,21.1 16.7,21.1 LL2.1
  Bottom 0.152: v19.82,23.6 19.07,23.6 18.7,23.98 18.2,23.98 17.82,23.6 17.82,23.1 v15.82,21.1
N$15  (1 unrouted)
N$17  (via drill 0.35)  (1 unrouted)
  Top 0.152: 16.45,22.73 14.82,22.73 14.07,21.98 14.07,20.73 14.2,20.6 15.45,20.6 16.17,19.88 16.2,19.88 16.48,19.6 LL3.1 | 16.45,22.73 16.45,22.35 CC10.1 | v30.2,18.23 30.2,18.1 27.57,18.1 26.7,18.98 P1.01/2.4B.P$E24 | v28.57,12.23 28.07,12.73 28.07,13.23 C15.1 28.07,13.35 28.07,14.73 C16.1 | 16.45,22.73 16.57,22.85 v16.57,25.35
  Bottom 0.152: 30.2,17.98 30.2,16.1 28.57,14.48 v28.57,12.23 | v16.57,25.35 17.95,25.35 18.2,25.6 18.95,25.6 19.45,25.1 29.32,25.1 31.32,27.1 31.82,27.1 32.2,26.73 32.2,19.98 30.2,17.98 | 30.2,17.98 v30.2,18.23
N$18  (1 unrouted)
  Top 0.152: P1.01/2.4B.P$D2 20.57,19.23 20.45,19.35 20.45,20.35 19.57,21.23 C17.1
N$19
  Top 0.152: R8.1 16.57,15.35 16.57,15.73 IC3.1
N$20
  Top 0.152: P1.01/2.4B.P$C1 19.7,19.02 19.7,17.6 19.5,17.6 19.19,17.29 CC5.2
N$21  (via drill 0.35)
  Top 0.152: C2-EP-DR.1 14.57,7.85 14.82,7.6 14.82,5.98 D1.1 14.95,5.85 14.95,3.98 v19.95,3.98 | v26.45,4.98 26.45,7.35 26.32,7.48 D2.2
  Bottom 0.152: v26.45,4.98 20.95,4.98 v19.95,3.98
N$22  (1 unrouted)
N$23  (via drill 0.35)
  Top 0.152: v36.7,9.85 36.7,10.48 37.2,10.98 R10.2 | v33.7,6.85 33.2,7.35 29.45,7.35 29.45,5.98 SJ1.2 | v17.2,23.35 17.32,23.48 17.32,27.1 16.95,27.1 R9.1 | v21.7,12.1 23.82,9.98 24.7,9.98 v24.7,7.1
  Bottom 0.152: v36.7,9.85 v33.7,6.85 32.95,6.1 32.33,6.1 31.32,7.1 v24.7,7.1 | v17.2,23.35 15.2,21.35 15.2,20.87 16.19,19.88 16.2,19.88 20.82,15.25 20.82,14.73 22.07,13.48 22.07,12.48 v21.7,12.1
N$24
  Top 0.152: C2-EP-DR.2 13.2,7.98 12.32,8.85 12.32,8.98 D3.2 | Q2.3 12.45,9.85 12.32,9.73 12.32,9.1 D3.2 | D3.2 12.2,8.98 6.57,3.35 5.95,3.35 L2.1
N$25  (via drill 0.35)
  Top 0.152: v9.07,20.1 9.07,21.73 11.2,21.73 J2.4 | v21.82,6.6 21.57,6.85 21.57,7.23 21.07,7.73 EPD_C2.2
  Bottom 0.152: v9.07,20.1 9.07,18.85 10.95,16.98 10.95,16.48 10.57,16.1 10.57,8.35 13.95,4.98 19.95,4.98 21.57,6.6 v21.82,6.6
N$26  (via drill 0.35)
  Top 0.152: v10.32,20.35 10.32,21.23 11.2,21.23 J2.5 | v19.7,5.6 20.82,5.6 20.82,6.48 EPD_C1.2
  Bottom 0.152: v10.32,20.35 10.32,19.85 11.7,18.48 11.7,13.6 11.32,13.23 11.32,10.85 14.82,7.35 17.95,7.35 v19.7,5.6
N$27  (via drill 0.35)
  Top 0.152: v19.7,25.73 20.52,25.73 R15.2 | v20.95,30.08 20.95,28.33 J3.B5
  Bottom 0.152: v20.95,30.08 19.7,28.83 v19.7,25.73
N$28  (1 unrouted)
N$29  (via drill 0.35)
  Top 0.152: v36.58,15.98 37.33,15.98 C5.2 | v39.2,18.6 38.58,18.6 38.58,18.23 R11.1
  Bottom 0.152: v39.2,18.6 v36.58,15.98
N$30  (via drill 0.35)
  Top 0.152: v11.95,11.1 11.32,11.73 J2.24 | v23.82,7.98 23.82,9.23 EPD_C12.2
  Bottom 0.152: v11.95,11.1 14.2,11.1 16.2,9.1 20.2,9.1 21.32,7.98 v23.82,7.98
N$31  (via drill 0.35)
  Top 0.152: v12.32,16.23 12.32,14.85 11.32,14.85 J2.18 | v12.7,20.48 13.82,20.48 14.45,19.85 14.7,19.85 EPD_C6.2
  Bottom 0.152: v12.32,16.23 12.32,20.1 v12.7,20.48
N$32
  Top 0.152: EPD_C8.2 9.62,13.35 10.57,13.35 10.95,13.73 11.2,13.73 J2.20
N$33
  Top 0.152: R12.1 38.45,16.1 37.45,17.1 C10.2
N$34  (via drill 0.35)
  Top 0.152: v17.2,9.85 17.2,8.73 18.07,7.85 EPD_C10.2 | v12.2,13.23 11.82,12.85 11.32,12.85 J2.22
  Bottom 0.152: v17.2,9.85 13.82,13.23 v12.2,13.23
N$35
  Top 0.152: R13.1 36.83,28.23 39.83,31.23 39.83,32.98 C11.2
N$36  (via drill 0.35)
  Top 0.152: v28.82,29.48 28.82,27.35 28.7,27.23 R14.1 | v23.95,30.85 23.95,28.35 J3.A5
  Bottom 0.152: v28.82,29.48 28.2,29.48 26.82,30.85 v23.95,30.85
N$37
  Top 0.152: IC4.A2 40.2,13.1 40.2,15.48 39.2,16.48 C3.2
OUT+  (via drill 0.35)
  Top 0.152: v40.83,13.73 40.83,13.1 IC4.A3 | v40.95,8.98 41.83,8.1 41.83,7.1 TP_SDA7.TP
  Bottom 0.152: v40.83,13.73 40.83,11.73 40.95,11.6 v40.95,8.98
OUT-
  Top 0.152: IC4.C3 40.83,11.98 42.2,10.6 42.2,9.98 42.33,9.85 43.58,9.85 43.58,12.48 TP_SDA8.TP
P0.13  (1 unrouted)
P0.14  (1 unrouted)
P1.01  (1 unrouted)
  Top 0.152: R7.1 32.83,9.85 35.7,9.85 35.7,9.6 Q1.1
P1.02  (via drill 0.35)
  Top 0.152: v30.2,13.23 30.2,13.85 29.2,13.85 28.7,14.35 28.7,15.48 26.7,15.48 P1.01/2.4B.P$W24 | v32.58,6.73 32.58,5.1 SW3.2
  Bottom 0.152: v30.2,13.23 32.58,10.85 v32.58,6.73
PMIC_INT  (1 unrouted)
PREVGH  (via drill 0.35)
  Top 0.152: EPD_C9.2 8.34,15.53 v9.77,14.1 | D3.1 8.82,9.1 8.82,9.15 v9.77,10.1 9.77,12.05 10.95,13.23 11.2,13.23 J2.21
  Bottom 0.152: v9.77,10.1 v9.77,14.1
PREVGL  (via drill 0.35)
  Top 0.152: v12.32,12.23 11.32,12.23 J2.23 | EPD_C11.2 14.7,11.48 14.95,11.48 15.45,10.98 15.45,10.73 v15.82,10.35 15.82,5.98 18.32,5.98 D1.2
  Bottom 0.152: v12.32,12.23 13.95,12.23 v15.82,10.35
RESET  (2 unrouted)
SCK  (1 unrouted)
SCL/1.4C  (via drill 0.35)
  Top 0.152: v38.45,11.85 38.45,11.98 39.7,11.98 IC4.C1 | v40.33,18.85 40.45,18.98 40.45,23.35 40.2,23.6 39.83,23.6 U1.7
  Bottom 0.152: v38.45,11.85 38.45,12.23 37.95,12.73 37.95,16.48 v40.33,18.85
SCL/2.4C  (via drill 0.35)  (3 unrouted)
  Top 0.152: v15.7,15.98 15.7,16.23 16.45,16.23 IC3.12 | v39.33,28.73 40.33,27.73 40.33,27.6 TP_SCL.TP 40.45,27.48 40.45,24.85 40.83,24.48 40.83,23.35 41.45,22.73 R2.1
  Bottom 0.152: v15.7,15.98 13.7,15.98 13.32,16.35 13.32,25.35 19.45,31.48 36.58,31.48 v39.33,28.73
SDA/1.4C  (1 unrouted)
SDA/2.4C  (via drill 0.35)  (3 unrouted)
  Top 0.152: v19.2,13.85 18.95,14.1 18.95,14.98 18.07,14.98 17.82,14.73 17.82,14.6 IC1.C1 | v18.07,12.73 16.95,11.6 TP_SDA.TP | v41.33,24.85 41.33,24.35 41.45,24.23 R3.1
  Bottom 0.152: v19.2,13.85 v18.07,12.73 21.7,9.1 26.32,9.1 29.2,11.98 29.2,14.6 39.45,24.85 v41.33,24.85
SWDCLK  (1 unrouted)
  Top 0.152: TP_SDA3.TP 27.45,11.1 27.45,14.23 26.7,14.98 P1.01/2.4B.P$AA24
SWDIO  (2 unrouted)
SWO
  Top 0.152: P1.01/2.4B.P$AD22 25.7,13.98 25.7,14.1 25.95,14.35 26.2,14.35 26.57,13.98 27.07,13.98 27.07,13.1 26.2,12.23 25.45,12.23 TP_SDA1.TP
VBAT/1.2A  (via drill 0.35)
  Top 0.152: U1.3 37.83,23.23 37.83,23.6 U1.2 37.7,23.73 37.08,23.73 v37.08,25.6 | C2.2 40.58,30.35 v41.2,29.73 43.33,27.6 43.33,26.6 TP_SDA9.TP
  Bottom 0.152: v41.2,29.73 v37.08,25.6
VBAT/2.5C  (1 unrouted)
VBUS/1.5D  (via drill 0.35)
  Top 0.152: v30.57,28.35 30.57,29.1 C42.2 | v31.82,28.35 33.45,28.35 33.45,29.35 D4.5 | J3.A9_B4 20.4,26.9 20.75,26.55 20.86,26.55 20.88,26.53 21.89,26.53 v22.57,25.85 22.57,25.98 C43.1 23.25,26.72 23.75,27.22 23.75,27.3 25.1,27.3 25.2,27.4 J3.A4_B9
  Bottom 0.152: v31.82,28.35 v30.57,28.35 28.07,25.85 v22.57,25.85
VBUS/2.6D  (via drill 0.35)  (1 unrouted)
  Top 0.152: 18.7,13.23 19.32,12.6 C21.1 | 18.7,13.23 18.57,13.35 18.57,14.1 IC1.A2 | v30.32,12.23 30.82,12.73 30.82,13.73 31.82,14.73 C38.1 | v18.95,8.48 18.7,8.73 18.7,13.23
  Bottom 0.152: v30.32,12.23 30.32,11.98 26.07,7.73 24.45,7.73 24.07,7.35 20.07,7.35 v18.95,8.48
VREG  (via drill 0.35)
  Top 0.152: v17.45,13.48 17.57,13.48 18.2,14.1 IC1.B2 | v21.57,10.1 20.7,10.1 20.7,9.6 C24.2 | v21.45,22.48 22.32,22.48 C39.1 | 43.2,23.98 43.58,23.98 IC2.A2 43.7,23.98 43.95,23.98 IC2.A3 | 43.2,23.98 41.95,23.98 v41.95,25.98 | v36.58,12.23 35.33,12.23 35.33,12.1 | 35.33,12.1 35.33,11.48 TP_VREG.TP 35.33,12.1 | 43.2,23.98 IC2.A1 | 35.33,12.1 33.08,12.1 C23.2 | v24.57,10.6 25.32,9.85 25.32,5.98 v25.7,5.6
  Bottom 0.152: v17.45,13.48 17.95,13.48 18.95,14.48 19.45,14.48 20.82,13.1 20.82,10.85 21.2,10.48 | v21.57,10.1 21.2,10.48 | v21.45,22.48 22.57,22.48 25.82,19.23 25.82,15.1 22.95,12.23 | 21.2,10.48 22.95,12.23 | v41.95,25.98 42.83,25.98 43.95,24.85 43.95,17.35 43.45,16.85 | 43.45,16.85 40.95,14.35 39.33,14.35 38.33,13.35 38.33,12.85 39.08,12.1 39.08,11.6 38.7,11.23 37.58,11.23 v36.58,12.23 | v24.57,10.6 22.95,12.23 | v25.7,5.6 31.82,5.6 32.08,5.35 40.7,5.35 43.45,8.1 43.45,16.85